# Altium project RX_FOR_PI.PrjPcb
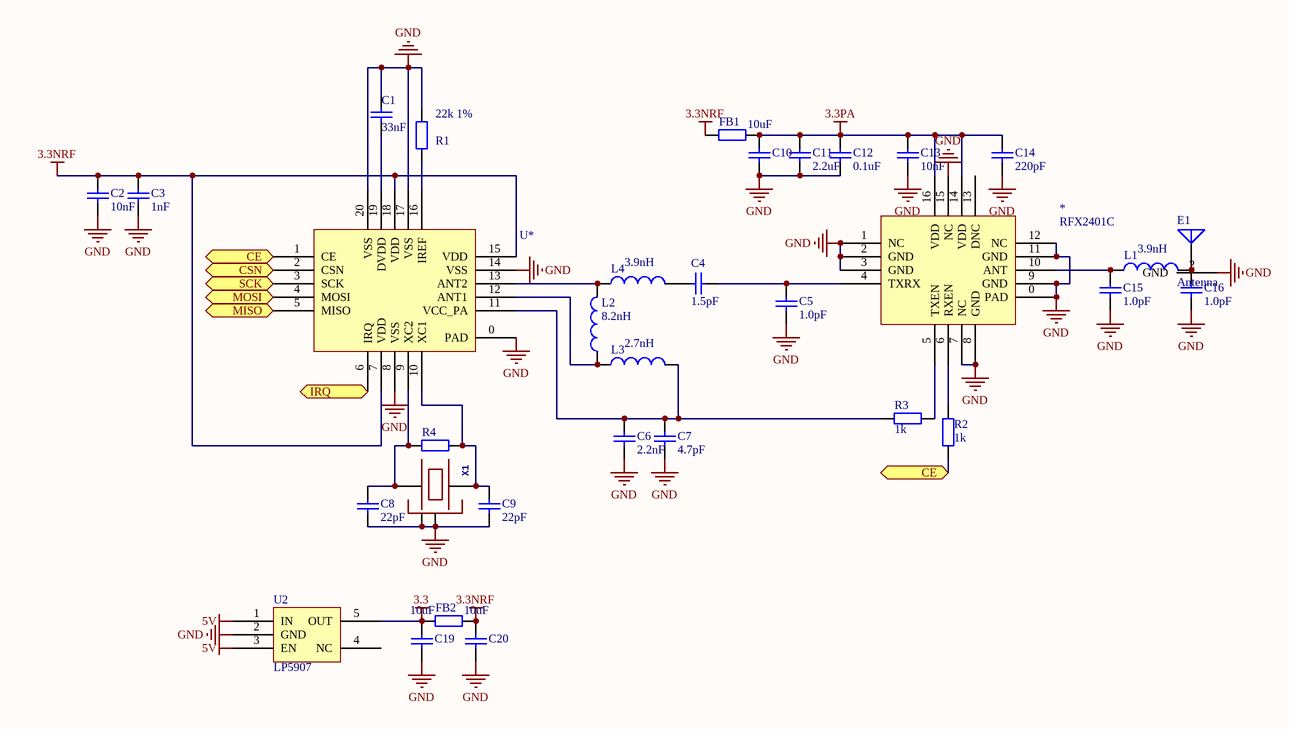
[diagram p0: RF.SchDoc]
2 sheets, 47 parts. Net scope: flat (ports and power ports of the same name join across sheets).
Board file: RX_FOR_PI.PcbDoc
Sheets:
  RF.SchDoc
  MCU.SchDoc

## Sheet RF.SchDoc
size A4

### Parts
*  RFX2401C  [RFX2401C]
C1  value 33nF  [0402]  (hidden comment: Cap)
C2  value 10nF  [0402]  (hidden comment: Cap)
C3  value 1nF  [0402]  (hidden comment: Cap)
C4  value 1.5pF  [0402]  (hidden comment: Cap)
C5  value 1.0pF  [0402]  (hidden comment: Cap)
C6  value 2.2nF  [0402]  (hidden comment: Cap)
C7  value 4.7pF  [0402]  (hidden comment: Cap)
C8  value 22pF  [0402]  (hidden comment: Cap)
C9  value 22pF  [0402]  (hidden comment: Cap)
C10  10uF  [0603]
C11  value 2.2uF  [0402]  (hidden comment: Cap)
C12  value 0.1uF  [0402]  (hidden comment: Cap)
C13  value 10nF  [0402]  (hidden comment: Cap)
C14  value 220pF  [0402]  (hidden comment: Cap)
C15  value 1.0pF  [0402]  (hidden comment: Cap)
C16  value 1.0pF  [0402]  (hidden comment: Cap)
C19  10uF  [0603]
C20  10uF  [0603]
E1  Antenna  [IPEX]
FB1  FB  [0402]  (value not drawn)
FB2  FB  [0402]  (value not drawn)
L1  value 3.9nH  [0402]  (hidden comment: Inductor)
L2  value 8.2nH  [0402]  (hidden comment: Inductor)
L3  value 2.7nH  [0402]  (hidden comment: Inductor)
L4  value 3.9nH  [0402]  (hidden comment: Inductor)
R1  value 22k 1%  [0402]  (hidden comment: Res2)
R2  value 1k  [0402]  (hidden comment: Res2)
R3  value 1k  [0402]  (hidden comment: Res2)
R4  1M  [0402]  (value not drawn)
U2  LP5907  [SOT23-5]
U*  NRF24L01  [NRF24L01]  (value not drawn)
X1  16Mhz  [OSCILLATOR-3.2X2.5]  (value not drawn)

### Ports
CE, CSN, IRQ, MISO, MOSI, SCK

### Nets
3.3: C19.1 FB2.1 U2.5(OUT)
3.3NRF: C2.1 C3.1 C20.1 FB1.1 FB2.2 U*.7(VDD) U*.15(VDD) U*.18(VDD)
3.3PA: *.14(VDD) *.16(VDD) C10.1 C11.1 C12.1 C13.1 C14.1 FB1.2
5V: U2.1(IN) U2.3(EN)
GND: *.0(PAD) *.1(NC) *.2(GND) *.3(GND) *.7(NC) *.8(GND) *.9(GND) *.11(GND) *.12(NC) *.15(NC) C1.1 C2.2 C3.2 C5.2 C6.2 C7.2 C8.2 C9.2 C10.2 C11.2 C12.2 C13.2 C14.2 C15.2 C16.2 C19.2 C20.2 E1.2(GND) R1.1 U2.2(GND) U*.0(PAD) U*.8(VSS) U*.14(VSS) U*.17(VSS) U*.20(VSS) X1.2(NC_2) X1.4(NC_4)
Net*_4: *.4(TXRX) C4.2 C5.1
Net*_5: *.5(TXEN) R3.2
Net*_6: *.6(RXEN) R2.2
Net*_10: *.10(ANT) C15.1 L1.1
NetC1_2: C1.2 U*.19(DVDD)
NetC4_1: C4.1 L4.2
NetC6_1: C6.1 C7.1 L3.2 R3.1 U*.11(VCC_PA)
NetC8_1: C8.1 R4.1 U*.9(XC2) X1.1
NetC9_1: C9.1 R4.2 U*.10(XC1) X1.3
NetC16_1: C16.1 E1.1(ANT) L1.2
NetL2_1: L2.1 L3.1 U*.12(ANT1)
NetL2_2: L2.2 L4.1 U*.13(ANT2)
NetR1_2: R1.2 U*.16(IREF)
NetR2_1: R2.1 U*.1(CE) ; port CE
NetU1_25: U*.2(CSN) ; port CSN
NetU1_26: U*.3(SCK) ; port SCK
NetU1_27: U*.5(MISO) ; port MISO
NetU1_28: U*.4(MOSI) ; port MOSI
NetU1_38: U*.6(IRQ) ; port IRQ

Not connected (* = marked no-connect by the designer): * 13(DNC); U2 4(NC)

### Library data of the parts
C1-C16 C19 C20 = Cap: Capacitor; Published: 8-Jun-2000; LatestRevisionDate: 17-Jul-2002; LatestRevisionNote: Re-released for DXP Platform.; PackageReference: RAD-0.3; Publisher: Altium Limited; PackageDescription: Radial Cap, Thru-Hole; 2 Leads; 0.3 in Pin Spacing
E1 = Antenna: Generic Antenna; Published: 24-Mar-1999; LatestRevisionDate: 17-Jul-2002; LatestRevisionNote: Re-released for DXP Platform.; PackageReference: PIN1; Publisher: Altium Limited
FB1 FB2 R1-R3 = Res2: Resistor; Published: 8-Jun-2000; LatestRevisionDate: 17-Jul-2002; LatestRevisionNote: Re-released for DXP Platform.; PackageReference: AXIAL-0.4; Publisher: Altium Limited; PackageDescription: Axial Device, Thru-Hole; 2 Leads; 0.4 in Pin Spacing
L1-L4 = Inductor: Code_IEC: 1005; Published: 8-Jun-2000; LatestRevisionDate: 29-May-2009; LatestRevisionNote: IPC-7351 Footprint Added.; PackageReference: 0402-A; Publisher: Altium Limited; PackageDescription: Chip Inductor; Code_JEITA: 0402
R4 = Res2: Resistor; Value: 1k; Published: 8-Jun-2000; LatestRevisionDate: 17-Jul-2002; LatestRevisionNote: Re-released for DXP Platform.; PackageReference: AXIAL-0.4; Publisher: Altium Limited; PackageDescription: Axial Device, Thru-Hole; 2 Leads; 0.4 in Pin Spacing
X1 = OSCILLATOR-3.2X2.5: Crystal Oscillator in 3.2x2.5 SMD

## Sheet MCU.SchDoc
size A4
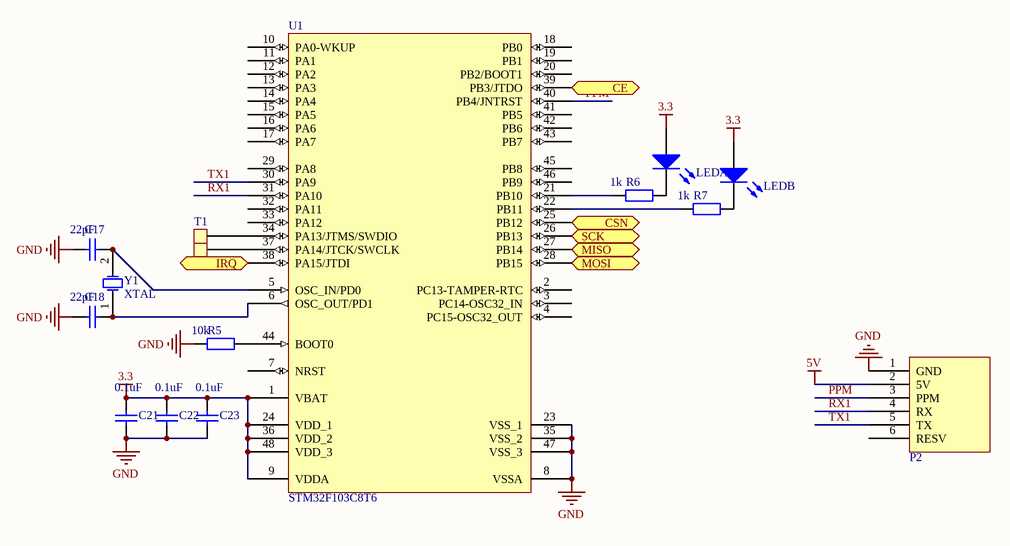
[diagram p1: MCU.SchDoc]

### Parts
C17  22pF  [0402]
C18  22pF  [0402]
C21  0.1uF  [0402]
C22  0.1uF  [0402]
C23  0.1uF  [0402]
LED  LEDx2  [LC-0603_Rx2]  (value not drawn)  (parts A,B of 2)
P2  PPMInf  [PPMInf]  (value not drawn)
R5  10k  [0402]
R6  1k  [0402]
R7  1k  [0402]
T1  TestPad  [TestPad - 1mm]  (value not drawn)
T2  TestPad  [TestPad - 1mm]  (value not drawn)
U1  STM32F103C8T6  [LQFP48_L]
Y1  XTAL  [5032-crystal]

### Ports
CE, CSN, IRQ, MISO, MOSI, SCK

### Nets
3.3: C21.1 C22.1 C23.1 LED.1(A) LED.2(A) U1.1(VBAT) U1.9(VDDA) U1.24(VDD_1) U1.36(VDD_2) U1.48(VDD_3)
5V: P2.2(5V)
GND: C17.1 C18.1 C21.2 C22.2 C23.2 P2.1(GND) R5.1 U1.8(VSSA) U1.23(VSS_1) U1.35(VSS_2) U1.47(VSS_3)
PPM: P2.3(PPM) U1.40(PB4/JNTRST)
RX1: P2.4(RX) U1.31(PA10)
TX1: P2.5(TX) U1.30(PA9)
NetC17_2: C17.2 U1.5(OSC_IN/PD0) Y1.2(OSC2)
NetC18_2: C18.2 U1.6(OSC_OUT/PD1) Y1.1(OSC1)
NetLED_3: LED.3(K) R6.2
NetLED_4: LED.4(K) R7.2
NetR2_1: U1.39(PB3/JTDO) ; port CE
NetR5_2: R5.2 U1.44(BOOT0)
NetR6_1: R6.1 U1.21(PB10)
NetR7_1: R7.1 U1.22(PB11)
NetT1_1: T1.1 U1.34(PA13/JTMS/SWDIO)
NetT2_1: T2.1 U1.37(PA14/JTCK/SWCLK)
NetU1_25: U1.25(PB12) ; port CSN
NetU1_26: U1.26(PB13) ; port SCK
NetU1_27: U1.27(PB14) ; port MISO
NetU1_28: U1.28(PB15) ; port MOSI
NetU1_38: U1.38(PA15/JTDI) ; port IRQ

Not connected (* = marked no-connect by the designer): P2 6(RESV); U1 2(PC13-TAMPER-RTC) 3(PC14-OSC32_IN) 4(PC15-OSC32_OUT) 7(NRST) 10(PA0-WKUP) 11(PA1) 12(PA2) 13(PA3) 14(PA4) 15(PA5) 16(PA6) 17(PA7) 18(PB0) 19(PB1) 20(PB2/BOOT1) 29(PA8) 32(PA11) 33(PA12) 41(PB5) 42(PB6) 43(PB7) 45(PB8) 46(PB9)

### Library data of the parts
C17 C18 C21-C23 = Cap: Capacitor; Published: 8-Jun-2000; LatestRevisionDate: 17-Jul-2002; LatestRevisionNote: Re-released for DXP Platform.; PackageReference: RAD-0.3; Publisher: Altium Limited; PackageDescription: Radial Cap, Thru-Hole; 2 Leads; 0.3 in Pin Spacing
LED = LEDx2: Typical RED GaAs LED; Published: 8-Jun-2000; LatestRevisionDate: 08-Jul-2005; LatestRevisionNote: Mech Layer 1 removed.; PackageReference: LED-1; Publisher: Altium Limited; PackageDescription: LED; 2 Leads
R5-R7 = Res2: Resistor; Value: 22k 1%; Published: 8-Jun-2000; LatestRevisionDate: 17-Jul-2002; LatestRevisionNote: Re-released for DXP Platform.; PackageReference: AXIAL-0.4; Publisher: Altium Limited; PackageDescription: Axial Device, Thru-Hole; 2 Leads; 0.4 in Pin Spacing
U1 = STM32F103C8T6: STM32 ARM-based 32-bit MCU with 64 Kbytes Flash, 48-pin LQFP, Industrial Temperature; Published: *; DatasheetVersion: *; PackageVersion: *; PackageReference: *; Publisher: *; PackageDescription: *; ComponentLink1Description: *; ComponentLink1URL: *; ComponentLink2Description: *; ComponentLink2URL: *
Y1 = XTAL: Crystal Oscillator; Published: 8-Jun-2000; LatestRevisionDate: 17-Jul-2002; LatestRevisionNote: Re-released for DXP Platform.; PackageReference: R38; Publisher: Altium Limited; PackageDescription: Crystal, Thru-Hole; 2 Leads; Body 3.1 x 8.2 mm (Dia.xH)

## Nets that join several sheets
3.3: RF (C19.1 FB2.1 U2.5), MCU (10 pins)
5V: RF (U2.1 U2.3), MCU (P2.2)
GND: RF (37 pins), MCU (11 pins)
NetR2_1: RF (R2.1 U*.1), MCU (U1.39)
NetU1_25: RF (U*.2), MCU (U1.25)
NetU1_26: RF (U*.3), MCU (U1.26)
NetU1_27: RF (U*.5), MCU (U1.27)
NetU1_28: RF (U*.4), MCU (U1.28)
NetU1_38: RF (U*.6), MCU (U1.38)